# EAGLE design V200_Roco_43928_PLUX22_J2_015_01_09 (EAGLE 5.10)
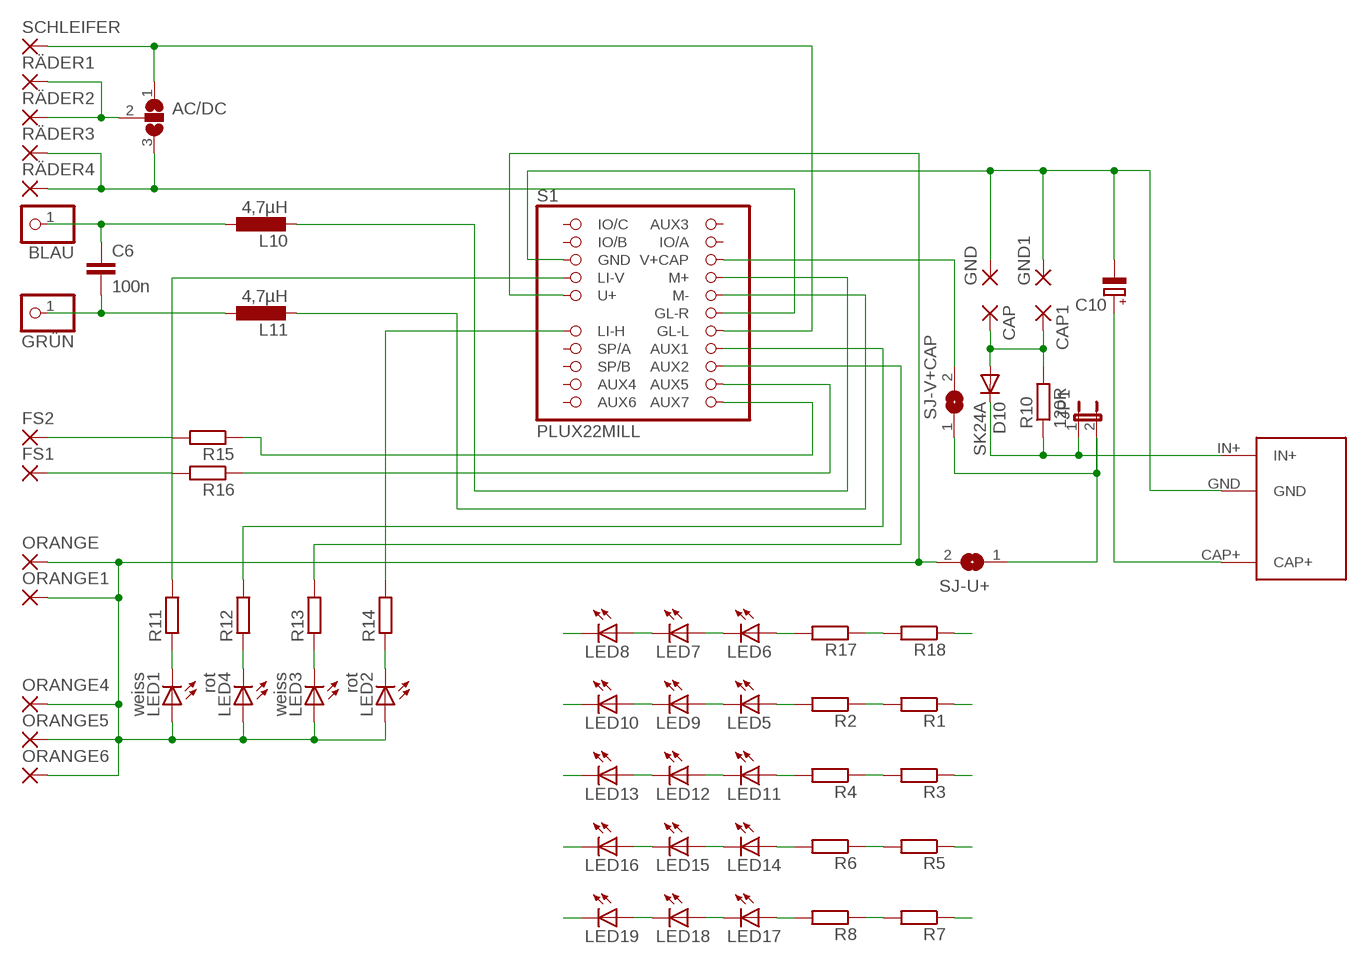
[diagram p0: schematic, sheet 1]

## Parts
AC/DC  SJ2W  [SJ_2]
BLAU  PINHD-1X1  [1X01]
C6  100n  C-EUC0603  [C0603]
C10  CPOL-EURECT2  [RECT-13X14-7]
CAP  SMD2  [SMD1,27-2,54]
CAP1  SMD2  [SMD1,27-2,54]
D10  SK24A  ES2D  [SMB]
FS1  SMD2  [SMD1,27-2,54]
FS2  SMD2  [SMD1,27-2,54]
GND  SMD2  [SMD1,27-2,54]
GND1  SMD2  [SMD1,27-2,54]
GRÜN  PINHD-1X1  [1X01]
JP1  JP1E2,00  [JP1_2]
L10  4,7µH  L-EUL1212  [L1212]
L11  4,7µH  L-EUL1212  [L1212]
LED1  weiss  LG_T679-F1G2-1  [PLCC2]
LED2  rot  LG_T679-F1G2-1  [PLCC2]
LED3  weiss  LG_T679-F1G2-1  [PLCC2]
LED4  rot  LG_T679-F1G2-1  [PLCC2]
LED5  LEDCHIPLED_0603-JP  [CHIPLED-0603-JP]
LED6  LEDCHIPLED_0603-JP  [CHIPLED-0603-JP]
LED7  LEDCHIPLED_0603  [CHIPLED_0603]
LED8  LEDCHIPLED_0603-JP  [CHIPLED-0603-JP]
LED9  LEDCHIPLED_0603  [CHIPLED_0603]
LED10  LEDCHIPLED_0603-JP  [CHIPLED-0603-JP]
LED11  LEDCHIPLED_0603-JP  [CHIPLED-0603-JP]
LED12  LEDCHIPLED_0603  [CHIPLED_0603]
LED13  LEDCHIPLED_0603-JP  [CHIPLED-0603-JP]
LED14  LEDCHIPLED_0603-JP  [CHIPLED-0603-JP]
LED15  LEDCHIPLED_0603  [CHIPLED_0603]
LED16  LEDCHIPLED_0603-JP  [CHIPLED-0603-JP]
LED17  LEDCHIPLED_0603-JP  [CHIPLED-0603-JP]
LED18  LEDCHIPLED_0603  [CHIPLED_0603]
LED19  LEDCHIPLED_0603-JP  [CHIPLED-0603-JP]
ORANGE  SMD2  [SMD1,27-2,54]
ORANGE1  SMD2  [SMD1,27-2,54]
ORANGE4  SMD2  [SMD1,27-2,54]
ORANGE5  SMD2  [SMD1,27-2,54]
ORANGE6  SMD2  [SMD1,27-2,54]
R1  R-EU_R0603S  [R0603S]
R2  R-EU_R0603S  [R0603S]
R3  R-EU_R0603S  [R0603S]
R4  R-EU_R0603S  [R0603S]
R5  R-EU_R0603S  [R0603S]
R6  R-EU_R0603S  [R0603S]
R7  R-EU_R0603S  [R0603S]
R8  R-EU_R0603S  [R0603S]
R10  120R  R-EU_R0603  [R0603]
R11  R-EU_R0603S  [R0603S]
R12  R-EU_R0603S  [R0603S]
R13  R-EU_R0603S  [R0603S]
R14  R-EU_R0603S  [R0603S]
R15  R-EU_R0603S  [R0603S]
R16  R-EU_R0603S  [R0603S]
R17  R-EU_R0603S  [R0603S]
R18  R-EU_R0603S  [R0603S]
RÄDER1  SMD2  [SMD1,27-2,54]
RÄDER2  SMD2  [SMD1,27-2,54]
RÄDER3  SMD2  [SMD1,27-2,54]
RÄDER4  SMD2  [SMD1,27-2,54]
S1  PLUX22MILL  [PLUX22_SMD_MILL]
SCHLEIFER  SMD2  [SMD1,27-2,54]
SJ-U+  SJ"  [SJ]
SJ-V+CAP  SJ"  [SJ]
U$1  PWR_CAPT  [POWER_CAP]

## Nets
AUX1: R12.2 S1.P16(AUX1)
AUX2: R14.2 S1.P13(LI-H)
BL: L10.2 S1.P8(M+)
BLAU: BLAU.1 C6.1 L10.1
CAP1: C10.+ U$1.CAP+
GN: L11.2 S1.P10(M-)
GND: C10.- GND1.1(P) GND.1(P) S1.P5(GND) U$1.GND
GRAU: R11.2 S1.P7(LI-V)
GRÜN: C6.2 GRÜN.1 L11.1
IN1: D10.C JP1.1 R10.1 U$1.IN+
LED+: R18.1
LED+1: R1.1
LED+2: R3.1
LED+3: R5.1
LED+4: R7.1
LED-: LED8.C
LED-1: LED10.C
LED-2: LED13.C
LED-3: LED16.C
LED-4: LED19.C
N$1: CAP1.1(P) CAP.1(P) D10.A R10.2
N$3: R16.1 S1.P20(AUX5)
N$4: FS1.1(P) R16.2
N$5: FS2.1(P) R15.2
N$6: R13.2 S1.P18(AUX2)
N$7: R15.1 S1.P22(AUX7)
N$8: LED6.C LED7.A
N$9: LED7.C LED8.A
N$10: LED6.A R17.2
N$11: R17.1 R18.2
N$12: S1.P6(V+CAP) SJ-V+CAP.2
N$13: JP1.2 SJ-U+.1 SJ-V+CAP.1
N$15: LED5.C LED9.A
N$16: LED9.C LED10.A
N$17: LED3.C R13.1
N$18: LED4.C R12.1
N$19: LED5.A R2.2
N$20: LED2.C R14.1
N$21: LED1.C R11.1
N$22: R1.2 R2.1
N$23: LED11.C LED12.A
N$24: LED12.C LED13.A
N$25: LED11.A R4.2
N$26: R3.2 R4.1
N$27: LED14.C LED15.A
N$28: LED15.C LED16.A
N$29: LED14.A R6.2
N$30: R5.2 R6.1
N$31: LED17.C LED18.A
N$32: LED18.C LED19.A
N$33: LED17.A R8.2
N$34: R7.2 R8.1
ORANGE: LED1.A LED2.A LED3.A LED4.A ORANGE1.1(P) ORANGE4.1(P) ORANGE5.1(P) ORANGE6.1(P) ORANGE.1(P) S1.P9(U+) SJ-U+.2
RÄDER: AC/DC.3 RÄDER3.1(P) RÄDER4.1(P) S1.P12(GL-R)
RÄDER2: AC/DC.2 RÄDER1.1(P) RÄDER2.1(P)
SCHLEIFER: AC/DC.1 S1.P14(GL-L) SCHLEIFER.1(P)
Unconnected: S1.P1(IO/C) S1.P2(AUX3) S1.P3(IO/B) S1.P4(IO/A) S1.P15(SP/A) S1.P17(SP/B) S1.P19(AUX4) S1.P21(AUX6)

## Library data of the parts
AC/DC = jumper:SJ2W: SMD solder JUMPER
BLAU GRÜN = pinhead:PINHD-1X1: PIN HEADER
C6 = rcl:C-EU: CAPACITOR, European symbol
C10 = rcl:CPOL-EU: POLARIZED CAPACITOR, European symbol
CAP CAP1 FS1 FS2 GND GND1 ORANGE ORANGE1 ORANGE4-ORANGE6 RÄDER1-RÄDER4 SCHLEIFER = wirepad:SMD2: SMD PAD
D10 = diode:ES2D: DIODE super fast rectifier, 2 A
JP1 = jumper:JP1E: JUMPER
L10 L11 = rcl:L-EU: INDUCTOR, European symbol
LED1-LED4 = led:*_T679-?-1: LC TOPLED® Low Current LED Source: http://catalog.osram-os.com .. LG_LS_LY_T679_OBS.pdf; COLOR: green
LED5-LED19 = led:LED: LED OSRAM: - CHIPLED LG R971, LG N971, LY N971, LG Q971, LY Q971, LO R971, LY R971 LH N974, LH R974 LS Q976, LO Q976, LY Q976 LO Q996 - Hyper CHIPLED LW Q18S LB Q993, LB Q99A, LB R99A - SideLED LS A670, LO A670, LY A670, LG A670, LP A670 LB A673, LV A673, LT A673, LW A673 LH A674 LY A675 LS A676, LA A676, LO A676, LY A676, LW A676 LS A679, LY A679, LG A679 - Hyper Micro SIDELED® LS Y876, LA Y876, LO Y876, LY Y876 LT Y87S - SmartLED LW L88C, LW L88S LB L89C, LB L89S, LG L890 LS L89K, LO L89K, LY L89K LS L896, LA L896, LO L896, LY L896 - TOPLED LS T670, LO T670, LY T670, LG T670, LP T670 LSG T670, LSP T670, LSY T670, LOP T670, LYG T670 LG T671, LOG T671, LSG T671 LB T673, LV T673, LT T673, LW T673 LH T674 LS T676, LA T676, LO T676, LY T676, LB T676, LH T676, LSB T676, LW T676 LB T67C, LV T67C, LT T67C, LS T67K, LO T67K, LY T67K, LW E67C LS E67B, LA E67B, LO E67B, LY E67B, LB E67C, LV E67C, LT E67C LW T67C LS T679, LY T679, LG T679 LS T770, LO T770, LY T770, LG T770, LP T770 LB T773, LV T773, LT T773, LW T773 LH T774 LS E675, LA E675, LY E675, LS T675 LS T776, LA T776, LO T776, LY T776, LB T776 LHGB T686 LT T68C, LB T68C - Hyper Mini TOPLED® LB M676 - Mini TOPLED Santana® LG M470 LS M47K, LO M47K, LY M47K Source: http://www.osram.convergy.de LUXEON: - LUMILED® LXK2-PW12-R00, LXK2-PW12-S00, LXK2-PW14-U00, LXK2-PW14-V00 LXK2-PM12-R00, LXK2-PM12-S00, LXK2-PM14-U00 LXK2-PE12-Q00, LXK2-PE12-R00, LXK2-PE12-S00, LXK2-PE14-T00, LXK2-PE14-U00 LXK2-PB12-K00, LXK2-PB12-L00, LXK2-PB12-M00, LXK2-PB14-N00, LXK2-PB14-P00, LXK2-PB14-Q00 LXK2-PR12-L00, LXK2-PR12-M00, LXK2-PR14-Q00, LXK2-PR14-R00 LXK2-PD12-Q00, LXK2-PD12-R00, LXK2-PD12-S00 LXK2-PH12-R00, LXK2-PH12-S00 LXK2-PL12-P00, LXK2-PL12-Q00, LXK2-PL12-R00 Source: www.luxeon.com KINGBRIGHT: KA-3528ASYC Source: www.kingbright.com
R1-R8 R10-R18 = rcl:R-EU_: RESISTOR, European symbol
S1 = pinhead:PLUX22
SJ-U+ SJ-V+CAP = jumper:SJ: SMD solder JUMPER
U$1 = pinhead:PWR_CAP

## Board
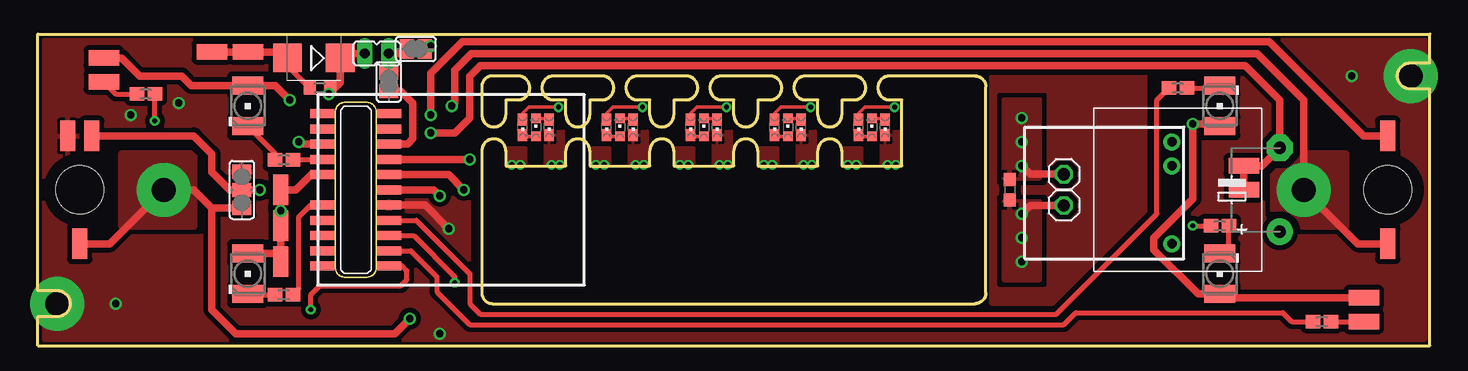
[diagram p1: board, top side]
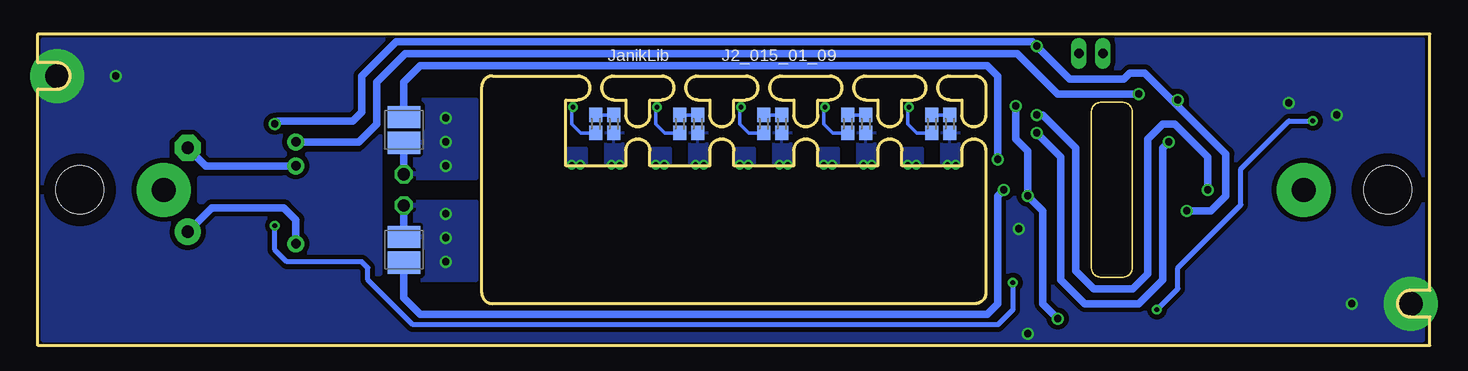
[diagram p2: board, bottom side, seen from below]

No outline drawn. Coordinates in mm, seen from the top.
Copper layers (1*16): Top 0.035mm / dielectric 1.5mm / Bottom 0.035mm
Design rules "default *": minimum track width 10mil, minimum drill 0.4mm, track to track 8mil, track to pad 8mil, pad to pad 8mil, via to via 8mil, smd to smd 8mil, copper to edge 40mil, drill to drill 8mil, minimum pad ring 10mil, minimum via ring 8mil, stop-mask expansion 4mil, vias tented up to drill 0mil, thermal gap 10mil
Holes 4 mm at 3.5,13 112.5,13
tRestrict: area 25,6 to 28,20; area 97.2,5.2 to 99.8,6.8; area 36.5,4.5 to 37,12; area 97.2,19.2 to 99.8,20.8; area 16.2,19.2 to 18.8,20.8; area 16.2,5.2 to 18.8,6.8
Milling: 102 lines

### Footprints (pad centres in the part's own frame; a part is rotated, then mirrored left to right if it is on the bottom)
SJ_2 = smd 1.168 x 1.6: 1 -1.524,0; 2 0,0; 3 1.524,0
1X01 = drill 1.016 octagon: 1 0,0
C0603 = smd 1.1 x 1: 1 -0.85,0; 2 0.85,0
RECT-13X14-7 = drill 1.016 pad 2.184 round: + -3.5,0 | drill 1.016 pad 2.184 octagon: - 3.5,0
SMD1,27-2,54 = smd 1.27 x 2.54: 1 0,0
SMB = smd 2.4 x 2.4: A 2.2,0; C -2.2,0
JP1_2 = drill 0.8 long: 1 0,-1; 2 0,1
L1212 = smd 1.85 x 2.7: 1 -1.075,0; 2 1.075,0
PLCC2 = smd 2.6 x 1.5: A 0,1.7; C 0,-1.7
CHIPLED-0603-JP = smd 0.8 x 1: A 0,-0.65; C 0,0.65
CHIPLED_0603 = smd 0.8 x 0.8: A 0,-0.75; C 0,0.75
R0603S = smd 1.2 x 1.1: 1 -0.75,0; 2 0.75,0
R0603 = smd 1 x 1.1: 1 -0.85,0; 2 0.85,0
PLUX22_SMD_MILL = smd 0.75 x 2: P1 -6.35,-2.792; P2 -6.35,2.792; P3 -5.08,-2.792; P4 -5.08,2.792; P5 -3.81,-2.792; P6 -3.81,2.792; P7 -2.54,-2.792; P8 -2.54,2.792; P9 -1.27,-2.792; P10 -1.27,2.792; P12 0,2.792; P13 1.27,-2.792; P14 1.27,2.792; P15 2.54,-2.792; P16 2.54,2.792; P17 3.81,-2.792; P18 3.81,2.792; P19 5.08,-2.792; P20 5.08,2.792; P21 6.35,-2.792; P22 6.35,2.792
SJ = smd 1.168 x 1.6: 1 -0.762,0; 2 0.762,0
POWER_CAP = drill 0.8 pad 1.422 round: CAP+ 0,-6.5; GND 0,0; IN+ 0,2

### Placement (x,y rotation side)
AC/DC  17,13 270 top
BLAU  85.5,14.3 0 top
C6  81,13 270 top
C10  103.5,13 90 top
CAP  17.5,24.5 90 top
CAP1  14.5,24.5 90 top
D10  23,24 180 top
FS1  110.5,2 90 top
FS2  5.5,22 90 top
GND  100.5,15 270 top
GND1  100.5,13 90 top
GRÜN  85.5,11.7 0 top
JP1  28.25,24.38 270 top
L10  85.5,18 90 bottom
L11  85.5,8 270 bottom
LED1  17.5,20 0 top
LED2  17.5,6 0 top
LED3  98.5,6 180 top
LED4  98.5,20 180 top
LED5  47.4,18.2 180 top
LED6  40.4,18.2 180 top
LED7  41.5,18.2 0 top
LED8  42.6,18.2 180 top
LED9  48.5,18.2 0 top
LED10  49.6,18.2 180 top
LED11  54.4,18.2 180 top
LED12  55.5,18.2 0 top
LED13  56.6,18.2 180 top
LED14  61.4,18.2 180 top
LED15  62.5,18.2 0 top
LED16  63.6,18.2 180 top
LED17  68.4,18.2 180 top
LED18  69.5,18.2 0 top
LED19  70.6,18.2 180 top
ORANGE  20.25,7 180 top
ORANGE1  20.25,10 180 top
ORANGE4  20.25,13 0 top
ORANGE5  110.5,4 90 top
ORANGE6  5.5,24 90 top
R1  47,18.5 90 bottom
R2  48.5,18.5 270 bottom
R3  54,18.5 90 bottom
R4  55.5,18.5 270 bottom
R5  61,18.5 90 bottom
R6  62.5,18.5 270 bottom
R7  68,18.5 90 bottom
R8  69.5,18.5 270 bottom
R10  23.5,21.5 180 top
R11  20.5,15.5 0 top
R12  95,21.5 180 top
R13  98.5,10 180 top
R14  20.5,4.25 0 top
R15  9,21 180 top
R16  107,2 0 top
R17  41.5,18.5 270 bottom
R18  40,18.5 90 bottom
RÄDER1  4.5,17.5 180 top
RÄDER2  112.5,17.5 180 top
RÄDER3  3.5,8.5 180 top
RÄDER4  112.5,8.5 180 top
S1  26.5,13 270 top
SCHLEIFER  2.5,17.5 180 top
SJ-U+  31.5,24.75 0 top
SJ-V+CAP  29.25,22 270 top
U$1  94.5,15 0 top

### Tracks (layer width: path | path; a pad name or v marks a point on that pad's centre or on a via)
AUX1
  Top 0.406: S1.P16 31.54,10.46 36,6 36,3.5 36.88,2.62 84.88,2.62 93.25,11 93.25,20.5 R12.2
AUX2
  Top 0.406: R14.2 21.75,4.75 21.75,10.75 22.73,11.73 S1.P13
BL  (via drill 0.6)
  Top 0.61: S1.P8 v36,15.54
  Bottom 0.61: L10.2 85.5,22 84.12,23.38 36.88,23.38 36,22.5 v36,15.54
BLAU  (via drill 0.6)
  Top 0.61: BLAU.1 82.7,14.3 v82,15
  Bottom 0.61: BLAU.1 L10.1
  other vias: 82,17 82,19
  pour Top (isolate 0.406): 83.5,14 83.5,20.5 80.5,20.5 80.5,14
  pour Bottom (isolate 0.406): 84.5,14 84.5,20.5 79.5,20.5 79.5,14
CAP1
  Bottom 0.61: U$1.CAP+ 94.5,10.5 95.5,11.5 101.5,11.5 C10.+
GN  (via drill 0.6)
  Top 0.61: S1.P10 34.23,14.27 v35.5,13
  Bottom 0.61: v35.5,13 36,12.5 36,3.5 36.88,2.62 84.12,2.62 85.5,4 L11.2
GND  (via drill 0.6)
  Top 0.61: S1.P5 21.94,16.81 v21.75,17 | v32.75,17.75 34.75,17.75 36,19 36,22.5 36.88,23.38 100.62,23.38 103.5,20.5 C10.- 102,15 GND.1 GND1.1
  Bottom 0.61: U$1.GND 102,15 C10.- | v21.75,17 22.25,16.5 22.25,5.5 24.25,3.5 28.75,3.5 30.75,5.5 30.75,15.75 v32.75,17.75
GRAU
  Top 0.406: S1.P7 21.29,15.54 R11.2
GRÜN  (via drill 0.6)
  Top 0.61: GRÜN.1 82.7,11.7 v82,11
  Bottom 0.61: L11.1 GRÜN.1
  other vias: 82,9 82,7
  pour Top (isolate 0.406): 83.5,5.5 83.5,12 80.5,12 80.5,5.5
  pour Bottom (isolate 0.406): 84.5,5.5 84.5,12 79.5,12 79.5,5.5
IN1  (via drill 0.6)
  Top 0.61: JP1.1 25.57,24.38 D10.C 25.2,21.95 24.62,21.38 | 24.62,21.38 v24.25,21 | R10.1 24.48,21.38 24.62,21.38
  Bottom 0.61: U$1.IN+ 89.25,17 87.75,18.5 87.75,22 85.38,24.38 34.38,24.38 31,21 v24.25,21
LED+  (via drill 0.4)
  other vias: 39.5,15.1 40.2,15.1
  pour Bottom: 39.2,15.2 39.2,18 40.7,18 40.7,15.2
  pour Top: 40.7,15.2 40.7,16.5 39.2,16.5 39.2,15.2
LED+1  (via drill 0.4)
  other vias: 46.5,15.1 47.2,15.1
  pour Bottom: 46.2,15.2 46.2,18 47.7,18 47.7,15.2
  pour Top: 47.7,15.2 47.7,16.5 46.2,16.5 46.2,15.2
LED+2  (via drill 0.4)
  other vias: 53.5,15.1 54.2,15.1
  pour Top: 54.7,15.2 54.7,16.5 53.2,16.5 53.2,15.2
  pour Bottom: 53.2,15.2 53.2,18 54.7,18 54.7,15.2
LED+3  (via drill 0.4)
  other vias: 60.5,15.1 61.2,15.1
  pour Bottom: 60.2,15.2 60.2,18 61.7,18 61.7,15.2
  pour Top: 61.7,15.2 61.7,16.5 60.2,16.5 60.2,15.2
LED+4  (via drill 0.4)
  other vias: 67.5,15.1 68.2,15.1
  pour Bottom: 67.2,15.2 67.2,18 68.7,18 68.7,15.2
  pour Top: 68.7,15.2 68.7,16.5 67.2,16.5 67.2,15.2
LED-  (via drill 0.4)
  other vias: 43.5,15.1 42.8,15.1
  pour Bottom: 43.8,15.2 43.8,16.5 42.3,16.5 42.3,15.2
  pour Top: 42.3,15.2 42.3,17.9 43.8,17.9 43.8,15.2
LED-1  (via drill 0.4)
  other vias: 50.5,15.1 49.8,15.1
  pour Top: 49.3,15.2 49.3,17.9 50.8,17.9 50.8,15.2
  pour Bottom: 50.8,15.2 50.8,16.5 49.3,16.5 49.3,15.2
LED-2  (via drill 0.4)
  other vias: 57.5,15.1 56.8,15.1
  pour Top: 56.3,15.2 56.3,17.9 57.8,17.9 57.8,15.2
  pour Bottom: 57.8,15.2 57.8,16.5 56.3,16.5 56.3,15.2
LED-3  (via drill 0.4)
  other vias: 64.5,15.1 63.8,15.1
  pour Bottom: 64.8,15.2 64.8,16.5 63.3,16.5 63.3,15.2
  pour Top: 63.3,15.2 63.3,17.9 64.8,17.9 64.8,15.2
LED-4  (via drill 0.4)
  other vias: 71.5,15.1 70.8,15.1
  pour Bottom: 71.8,15.2 71.8,16.5 70.3,16.5 70.3,15.2
  pour Top: 70.3,15.2 70.3,17.9 71.8,17.9 71.8,15.2
N$1
  Top 0.406: R10.2 20.8,23.35 D10.A
  Top 0.61: D10.A 20.3,24.5 CAP.1 CAP1.1
N$2
  pour Bottom (isolate 0.406, rank 2): 87.5,17.5 87.5,7.75 87.5,6 88,6 89.75,7.75 93.75,7.75 93.75,10.75 95,12 102.5,12 102.5,14 95.5,14 93.5,16 89,16
N$3
  Top 0.406: S1.P20 31.08,7.92 33.25,5.75 33.25,4.5 36,1.75 85.5,1.75 86.5,2.75 103.75,2.75 104.5,2 R16.1
N$4
  Top 0.406: R16.2 FS1.1
N$5
  Top 0.406: FS2.1 6.5,21 R15.2
N$6  (via drill 0.4)
  Top 0.406: S1.P18 31.31,9.19 34.75,5.75 v34.75,5.25 | v96.25,10 R13.2
  Bottom 0.406: v34.75,5.25 34.75,3 36,1.75 84.75,1.75 88.5,5.5 88.5,6.5 89,7 95.25,7 96.25,8 v96.25,10
N$7  (via drill 0.4)
  Top 0.406: S1.P22 30.35,6.65 30.75,6.25 30.75,5.5 30.25,5 23.5,5 22.75,4.25 v22.75,3 | v9.75,18.75 R15.1
  Bottom 0.406: v9.75,18.75 11.75,18.75 15.75,14.75 15.75,11.75 21,6.5 21,4.75 v22.75,3
N$8
  Top 0.305: LED7.A 40.4,17.45 LED6.C
N$9
  Top 0.305: LED7.C 42.6,18.95 LED8.A
N$10  (via drill 0.4)
  Top 0.305: v43.4,19.9 40.9,19.9 40.4,19.4 LED6.A
  Bottom 0.305: v43.4,19.9 43.5,19.8 43.5,18.5 42.75,17.75 R17.2
N$11
  Bottom 0.305: R18.2 R17.1
N$12
  Top 0.61: S1.P6 30.81,16.81 31.26,17.26 31.26,20.24 30.26,21.24 SJ-V+CAP.2
N$13
  Top 0.61: SJ-V+CAP.1 JP1.2 30.36,24.38 SJ-U+.1
N$14
  pour Top (isolate 0.406, rank 2): 92.25,11.25 84.5,3.5 79.5,3.5 79.5,22.5 92.25,22.5
N$15
  Top 0.305: LED9.A 47.4,17.45 LED5.C
N$16
  Top 0.305: LED9.C 49.6,18.95 LED10.A
N$17
  Top 0.406: LED3.C 99.25,8.45 R13.1
N$18
  Top 0.406: R12.1 98.3,21.5 LED4.C
N$19  (via drill 0.4)
  Top 0.305: LED5.A 47.4,19.4 47.9,19.9 v50.4,19.9
  Bottom 0.305: R2.2 49.75,17.75 50.5,18.5 50.5,19.8 v50.4,19.9
N$20
  Top 0.406: R14.1 17.55,4.25 LED2.C
N$21
  Top 0.406: R11.1 19.75,16.05 LED1.C
N$22
  Bottom 0.305: R1.2 R2.1
N$23
  Top 0.305: LED12.A 54.4,17.45 LED11.C
N$24
  Top 0.305: LED12.C 56.6,18.95 LED13.A
N$25  (via drill 0.4)
  Top 0.305: LED11.A 54.4,19.4 54.9,19.9 v57.4,19.9
  Bottom 0.305: R4.2 56.75,17.75 57.5,18.5 57.5,19.8 v57.4,19.9
N$26
  Bottom 0.305: R3.2 R4.1
N$27
  Top 0.305: LED15.A 61.4,17.45 LED14.C
N$28
  Top 0.305: LED15.C 63.6,18.95 LED16.A
N$29  (via drill 0.4)
  Top 0.305: LED14.A 61.4,19.4 61.9,19.9 v64.4,19.9
  Bottom 0.305: R6.2 63.75,17.75 64.5,18.5 64.5,19.8 v64.4,19.9
N$30
  Bottom 0.305: R5.2 R6.1
N$31
  Top 0.305: LED18.A 68.4,17.45 LED17.C
N$32
  Top 0.305: LED18.C 70.6,18.95 LED19.A
N$33  (via drill 0.4)
  Top 0.305: LED17.A 68.4,19.4 68.9,19.9 v71.4,19.9
  Bottom 0.305: R8.2 70.75,17.75 71.5,18.5 71.5,19.8 v71.4,19.9
N$34
  Bottom 0.305: R7.2 R8.1
ORANGE  (via drill 0.6)
  Top 0.61: S1.P9 22.77,14.27 21.5,13 ORANGE4.1 v20.25,11.25 ORANGE1.1 20.25,7.7 | 20.25,7.7 ORANGE.1 | ORANGE6.1 7,24 8.5,22.5 12,22.5 12.8,21.7 LED1.A 19.8,21.7 v21,20.5 | ORANGE5.1 98.8,4 LED3.A 96.7,4.3 93,8 93,9 96.25,12.25 v96.25,18.5 98.3,18.5 LED4.A | LED2.A 20.25,7.7 | SJ-U+.2 32.5,24.75 v32.75,25
  Bottom 0.61: v96.25,18.5 96,18.75 89.75,18.75 89,19.5 89,22.5 86.12,25.38 33.12,25.38 v32.75,25 30,22.25 25.5,22.25 25,22.75 23.75,22.75 21.25,20.25 | v20.25,11.25 18.25,11.25 17,12.5 17,16 21.25,20.25 | 21.25,20.25 v21,20.5
RÄDER  (via drill 0.6, 2 pad 4.5)
  Top 0.61: S1.P12 33,13 v33.5,12.5 | v31,2.25 29.75,1 16.5,1 14.5,3 14.5,11.48 | RÄDER3.1 6,8.5 v10.5,13 12.98,13 14.5,11.48 | 14.5,11.48 AC/DC.3 | RÄDER4.1 110,8.5 v105.5,13 105.5,20.5 101.62,24.38 36.12,24.38 34.75,23 34.75,20.25 v34.5,20
  Bottom 0.61: v31,2.25 32.25,3.5 32.25,11.25 v33.5,12.5 33.5,16.25 34.5,17.25 v34.5,20
  pour Top (isolate 0.61): 109,16 103,16 103,10 109,10
  pour Top (isolate 0.61): 7,16 13,16 13,10 7,10
RÄDER2  (via drill 0.6)
  Top 0.61: RÄDER1.1 13,17.5 14.5,16 14.5,14.5 16,13 AC/DC.2 v18.5,13 | RÄDER2.1 110.5,17.5 102.62,25.38 35.38,25.38 32.75,22.75 v32.75,19.25
  Bottom 0.61: v18.5,13 18.5,15.75 21.25,18.5 22.25,18.5 23.5,17.25 23.5,6 24.75,4.75 28,4.75 29.5,6.25 29.5,16.5 32.25,19.25 v32.75,19.25
SCHLEIFER  (via drill 0.6, 2 pad 4.5)
  Top 0.61: S1.P14 32.27,11.73 v34.25,9.75 | AC/DC.1 16.98,14.52
  other vias: 1.6,3.5 114.4,22.5 33.5,1 11.75,20.25 7.75,19.25 6.5,3.5 109.5,22.5
  pour Top (isolate 0.406, rank 2): 0.57,25.5 115.57,25.5 115.57,0.5 0.57,0.5
  pour Bottom (isolate 0.406, rank 2): 0.57,25.5 115.57,25.5 115.57,0.5 0.57,0.5

### Text on the board
bNames: J2_015_01_09 | JanikLib
tStop: 25VC+ | + | AUX7 | V200 PLUX22 | Roco 43928 | Rad2 | Rad2 | PuKo | DC | Rad1 | AC | Rad1 | + | PLUX22 | AUX5 | design by Janik Merz
bStop: V+ | GND | GND | PWR-Cap V1 | CAP+ | CAP+ | 5,4V